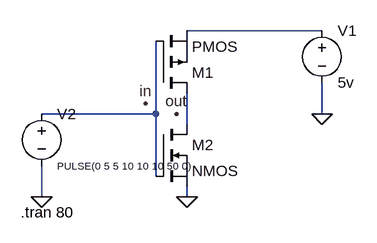
[diagram p0: schematic Draft1.asc]
Draft1.asc, the LTspice schematic file:
Version 4
SHEET 1 880 680
WIRE 416 -240 208 -240
WIRE 160 -112 160 -224
WIRE 160 -112 -16 -112
WIRE 416 -112 416 -160
WIRE 208 -96 208 -144
WIRE 160 -16 160 -112
WIRE -16 16 -16 -32
WIRE 208 16 208 0
FLAG -16 16 0
FLAG 208 16 0
FLAG 416 -112 0
FLAG 192 -112 out
FLAG 144 -128 in
SYMBOL pmos 160 -144 M180
SYMATTR InstName M1
SYMBOL nmos 160 -96 R0
SYMATTR InstName M2
SYMBOL voltage 416 -256 R0
WINDOW 123 0 0 Left 0
WINDOW 39 0 0 Left 0
SYMATTR InstName V1
SYMATTR Value 5v
SYMBOL voltage -16 -128 R0
WINDOW 123 0 0 Left 0
WINDOW 39 0 0 Left 0
WINDOW 3 24 96 Left 1
SYMATTR InstName V2
SYMATTR Value PULSE(0 5 5 10 10 10 50 0)
TEXT -48 40 Left 2 !.tran 80

The netlist it stands for:
* Draft1.asc
M1 N003 N002 N001 N001 PMOS
M2 N003 N002 0 0 NMOS
V1 N001 0 5v
V2 N002 0 PULSE(0 5 5 10 10 10 50 0)
.model NMOS NMOS
.model PMOS PMOS
.lib standard.mos
.tran 80
.backanno
.end